# EAGLE design biCycles (EAGLE 5.11)

## Sheet 1 of 3
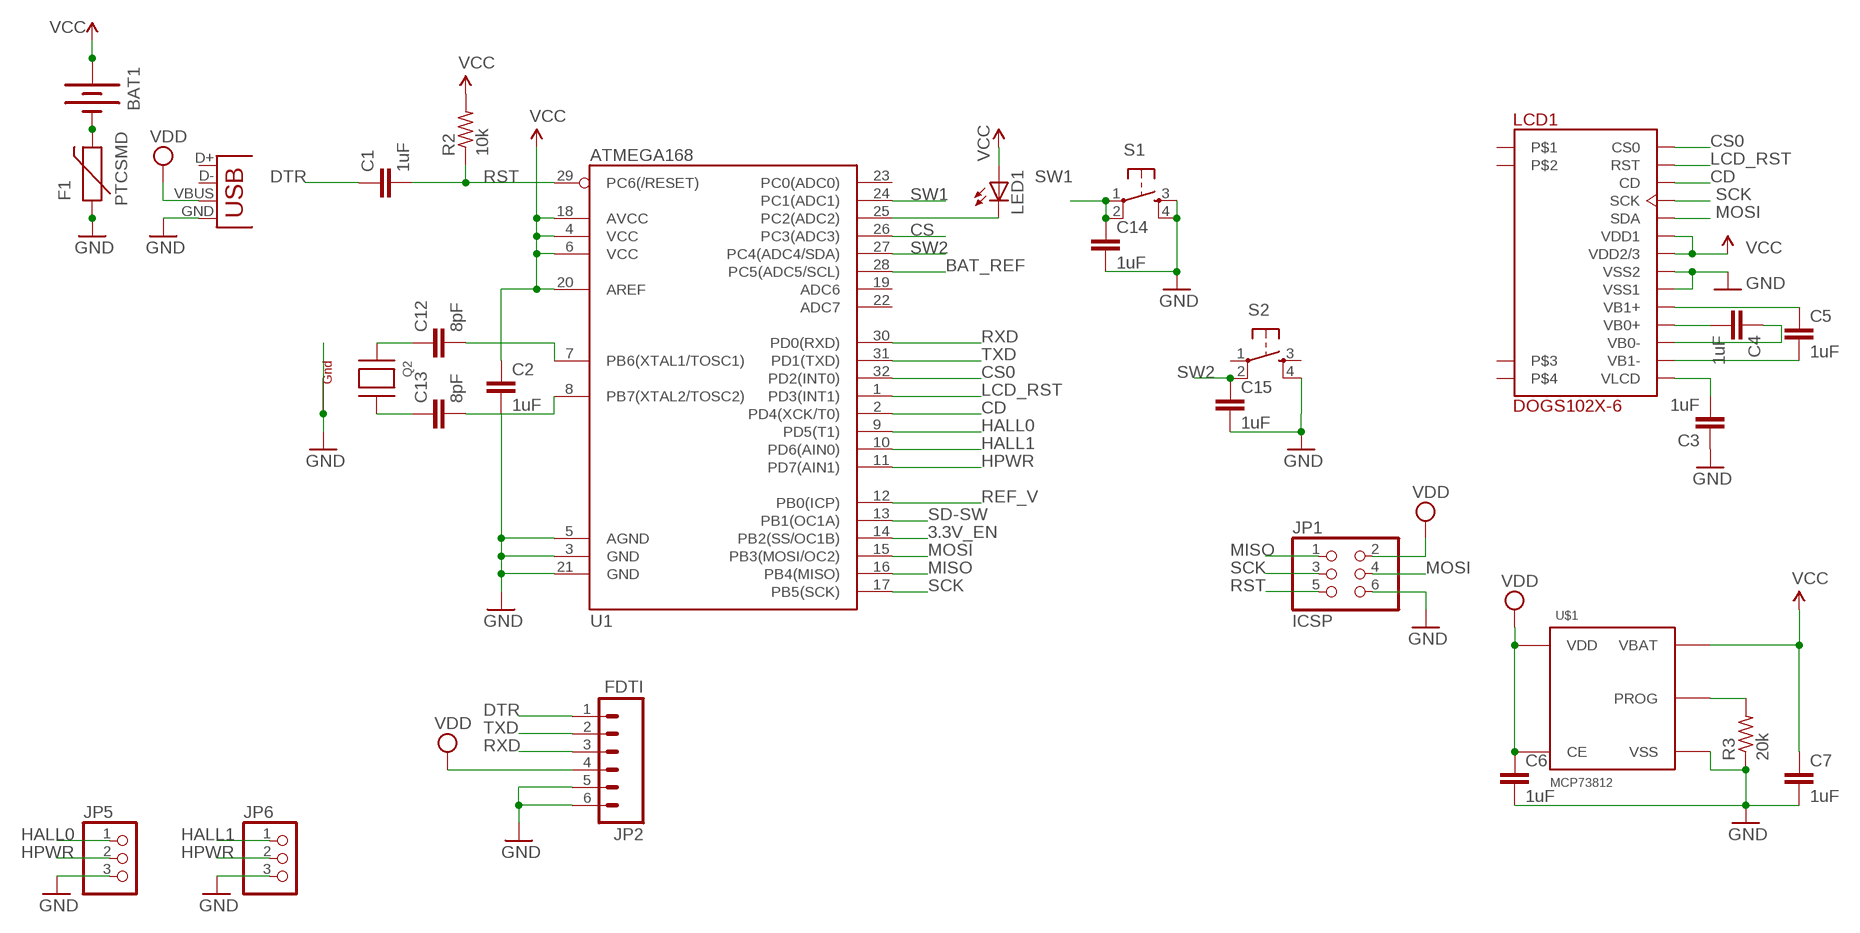
[diagram p0: schematic, sheet 1]

### Parts
BAT1  BATTERY245PTH  [BATTCON_245MM_PTH]
C1  1uF  C-EUC1206  [C1206]
C2  1uF  C-EUC1206  [C1206]
C3  1uF  C-EUC1206  [C1206]
C4  1uF  C-EUC1206  [C1206]
C5  1uF  C-EUC1206  [C1206]
C6  1uF  C-EUC1206  [C1206]
C7  1uF  C-EUC1206  [C1206]
C12  8pF  C-EUC0805  [C0805]
C13  8pF  C-EUC0805  [C0805]
C14  1uF  C-EUC1206  [C1206]
C15  1uF  C-EUC1206  [C1206]
F1  PTCSMD  [PTC-1206]
JP1  ICSP  PINHD-2X3  [2X03]
JP2  FDTI  M06LONGPADS  [1X06_LONGPADS]
JP5  PINHD-1X3  [1X03]
JP6  PINHD-1X3  [1X03]
LCD1  DOGS102X-6  [LCD-28-DIP]
LED1  LED1206  [LED-1206]
Q2  XTAL-4-3225  [NX3225]
R2  10k  R-US_R1206  [R1206]
R3  20k  R-US_R0805  [R0805]
S1  TAC_SWITCHPTH  [TACTILE-PTH]
S2  TAC_SWITCHPTH  [TACTILE-PTH]
U1  ATMEGA168  [TQFP32-08]
U$1  MCP73812  [MCP7381*]
X1  USBSMD  [USB-MINIB]

### Nets
3.3V_EN: U1.14(PB2(SS/OC1B)) ; also sheet 2
BAT_REF: U1.28(PC5(ADC5/SCL))
CD: LCD1.P$26(CD) U1.2(PD4(XCK/T0))
CS: U1.26(PC3(ADC3)) ; also sheet 2
CS0: LCD1.P$28(CS0) U1.32(PD2(INT0))
DTR: C1.1 JP2.1
GND: C2.2 C3.1 C6.2 C7.2 C14.2 C15.2 F1.1 JP1.6 JP2.5 JP2.6 JP5.3 JP6.3 LCD1.P$20(VSS1) LCD1.P$21(VSS2) Q2.2(G2) Q2.4(G1) R3.1 S1.3 S1.4 S2.4 U1.3(GND) U1.5(AGND) U1.21(GND) U$1.VSS X1.GND ; also sheet 2
HALL0: JP5.1 U1.9(PD5(T1))
HALL1: JP6.1 U1.10(PD6(AIN0))
HPWR: JP5.2 JP6.2 U1.11(PD7(AIN1))
LCD_RST: LCD1.P$27(RST) U1.1(PD3(INT1))
MISO: JP1.1 U1.16(PB4(MISO)) ; also sheet 2
MOSI: JP1.4 LCD1.P$24(SDA) U1.15(PB3(MOSI/OC2)) ; also sheet 2
N$1: LED1.C U1.25(PC2(ADC2))
N$2: C3.2 LCD1.P$15(VLCD)
N$3: C5.1 LCD1.P$19(VB1+)
N$4: R3.2 U$1.PROG
N$6: C12.1 Q2.1(X1)
N$7: C5.2 LCD1.P$16(VB1-)
N$8: C4.2 LCD1.P$18(VB0+)
N$9: C4.1 LCD1.P$17(VB0-)
N$14: BAT1.2(-) F1.2
N$15: C13.1 Q2.3(X2)
N$16: C13.2 U1.8(PB7(XTAL2/TOSC2))
N$17: C12.2 U1.7(PB6(XTAL1/TOSC1))
REF_V: U1.12(PB0(ICP))
RST: C1.2 JP1.5 R2.1 U1.29(PC6(/RESET))
RXD: JP2.3 U1.30(PD0(RXD))
SCK: JP1.3 LCD1.P$25(SCK) U1.17(PB5(SCK)) ; also sheet 2
SD-SW: U1.13(PB1(OC1A)) ; also sheet 2
SW1: C14.1 S1.1 S1.2 U1.24(PC1(ADC1))
SW2: C15.1 S2.2 U1.27(PC4(ADC4/SDA))
TXD: JP2.2 U1.31(PD1(TXD))
VCC: BAT1.1(+1) BAT1.3(+) C2.1 C7.1 LCD1.P$22(VDD2/3) LCD1.P$23(VDD1) LED1.A R2.2 U1.4(VCC) U1.6(VCC) U1.18(AVCC) U1.20(AREF) U$1.VBAT ; also sheet 2
VDD: C6.1 JP1.2 JP2.4 U$1.CE U$1.VDD X1.VBUS
Unconnected: LCD1.P$1 LCD1.P$2 LCD1.P$13 LCD1.P$14 S2.1 S2.3 U1.19(ADC6) U1.22(ADC7) U1.23(PC0(ADC0)) X1.D+ X1.D-

## Sheet 2 of 3
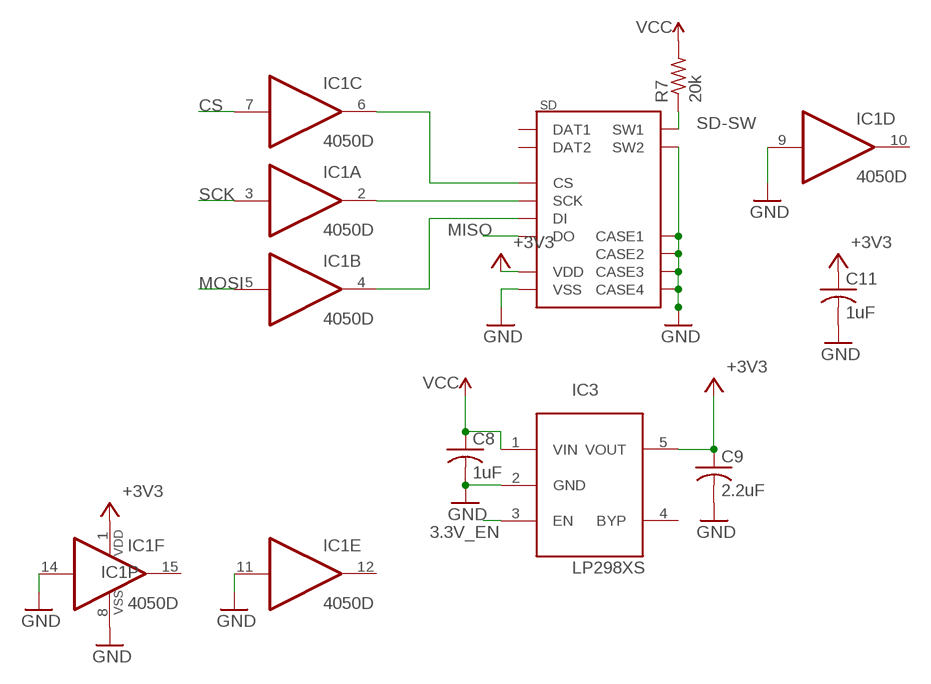
[diagram p1: schematic, sheet 2]

### Parts
C8  1uF  C-USC1206K  [C1206K]
C9  2.2uF  C-USC1206K  [C1206K]
C11  1uF  C-USC1206K  [C1206K]
IC1  4050D  [SO16]
IC3  LP298XS  [SOT23-5L]
R7  20k  R-US_R0805  [R0805]
SD  MICRO-SD  [MICRO-SD]

### Nets
3.3V_EN: IC3.3(EN) ; also sheet 1
3V3: C9.1 C11.1 IC1.1(P:VDD) IC3.5(VOUT) SD.P$4(VDD) ; supply symbol labelled +3V3
CS: IC1.7(C:I) ; also sheet 1
GND: C8.2 C9.2 C11.2 IC1.8(P:VSS) IC1.9(D:I) IC1.11(E:I) IC1.14(F:I) IC3.2(GND) SD.CASE$1(CASE1) SD.CASE$2(CASE2) SD.CASE$3(CASE3) SD.CASE-4(CASE4) SD.P$6(VSS) SD.P$10(SW2) ; also sheet 1
MISO: SD.P$7(DO) ; also sheet 1
MOSI: IC1.5(B:I) ; also sheet 1
N$10: IC1.6(C:O) SD.P$2(CS)
N$12: IC1.2(A:O) SD.P$5(SCK)
N$13: IC1.4(B:O) SD.P$3(DI)
SCK: IC1.3(A:I) ; also sheet 1
SD-SW: R7.1 SD.P$9(SW1) ; also sheet 1
VCC: C8.1 IC3.1(VIN) R7.2 ; also sheet 1
Unconnected: IC1.10(D:O) IC1.12(E:O) IC1.15(F:O) IC3.4(BYP) SD.P$1(DAT2) SD.P$8(DAT1)

## Sheet 3 of 3

## Library data of the parts
BAT1 = SparkFun:BATTERY: Battery Holders Various common sizes : AA, AAA, 20mm coin cell and 12mm coin cell.
C1-C7 C12-C15 = makani_rcl:C-EU: CAPACITOR, European symbol
C8 C9 C11 = adafruit:C-US: CAPACITOR, American symbol
F1 = SparkFun:PTC: Resettable Fuse PTC Resettable Fuse. Spark Fun Electronics SKU : COM-08357
IC1 = 40xx:4050: Hex non-inverting BUFFER
IC3 = adafruit:LP298X
JP1 = pinhead:PINHD-2X3: PIN HEADER
JP2 = SparkFun:M06: Header 6 Standard 6-pin 0.1" header. Use with straight break away headers (SKU : PRT-00116), right angle break away headers (PRT-00553), swiss pins (PRT-00743), machine pins (PRT-00117), and female headers (PRT-00115). Molex polarized connector foot print use with SKU : PRT-08094 with associated crimp pins and housings. NOTES ON THE VARIANTS LOCK and LOCK_LONGPADS... This footprint was designed to help hold the alignment of a through-hole component (i.e. 6-pin header) while soldering it into place. You may notice that each hole has been shifted either up or down by 0.005 of an inch from it's more standard position (which is a perfectly straight line). This slight alteration caused the pins (the squares in the middle) to touch the edges of the holes. Because they are alternating, it causes a "brace" to hold the component in place. 0.005 has proven to be the perfect amount of "off-center" position when using our standard breakaway headers. Although looks a little odd when you look at the bare footprint, once you have a header in there, the alteration is very hard to notice. Also, if you push a header all the way into place, it is covered up entirely on the bottom side. This idea of altering the position of holes to aid alignment will be further integrated into the Sparkfun Library for other footprints. It can help hold any component with 3 or more connection pins.
JP5 JP6 = pinhead:PINHD-1X3: PIN HEADER
LCD1 = josh:DOGS102X-6: Electronic Assemblies DOGS LCD Module This part describes the EA DOGS102x-6 module, a 102x64 pixel LCD display.
LED1 = SparkFun:LED: LEDs Standard schematic elements and footprints for 5mm, 3mm, 1206, and 0603 sized LEDs. 5mm - Spark Fun Electronics SKU : COM-00529 (and others)
Q2 = adafruit:XTAL-4: Classic 4-pin 3.2 x 2.5mm crystal
R2 R3 R7 = rcl:R-US_: RESISTOR, American symbol
S1 S2 = SparkFun:TAC_SWITCH: Momentary Switch Button commonly used for reset or general input. Spark Fun Electronics SKU : COM-00097
SD = josh:MICRO-SD: This micro-sd connector
U1 = SparkFun:ATMEGA168
U$1 = josh:MCP73812
X1 = SparkFun:USB: USB Connectors USB-B-PTH is fully proven SKU : PRT-00139 USB-miniB is fully proven SKU : PRT-00587 USB-A-PCB is untested. USB-A-H is throughly reviewed, but untested. Spark Fun Electronics SKU : PRT-00437 USB-B-SMT is throughly reviewed, but untested. Needs silkscreen touching up. USB-A-S has not been used/tested USB-MB-H has not been used/tested

## Board
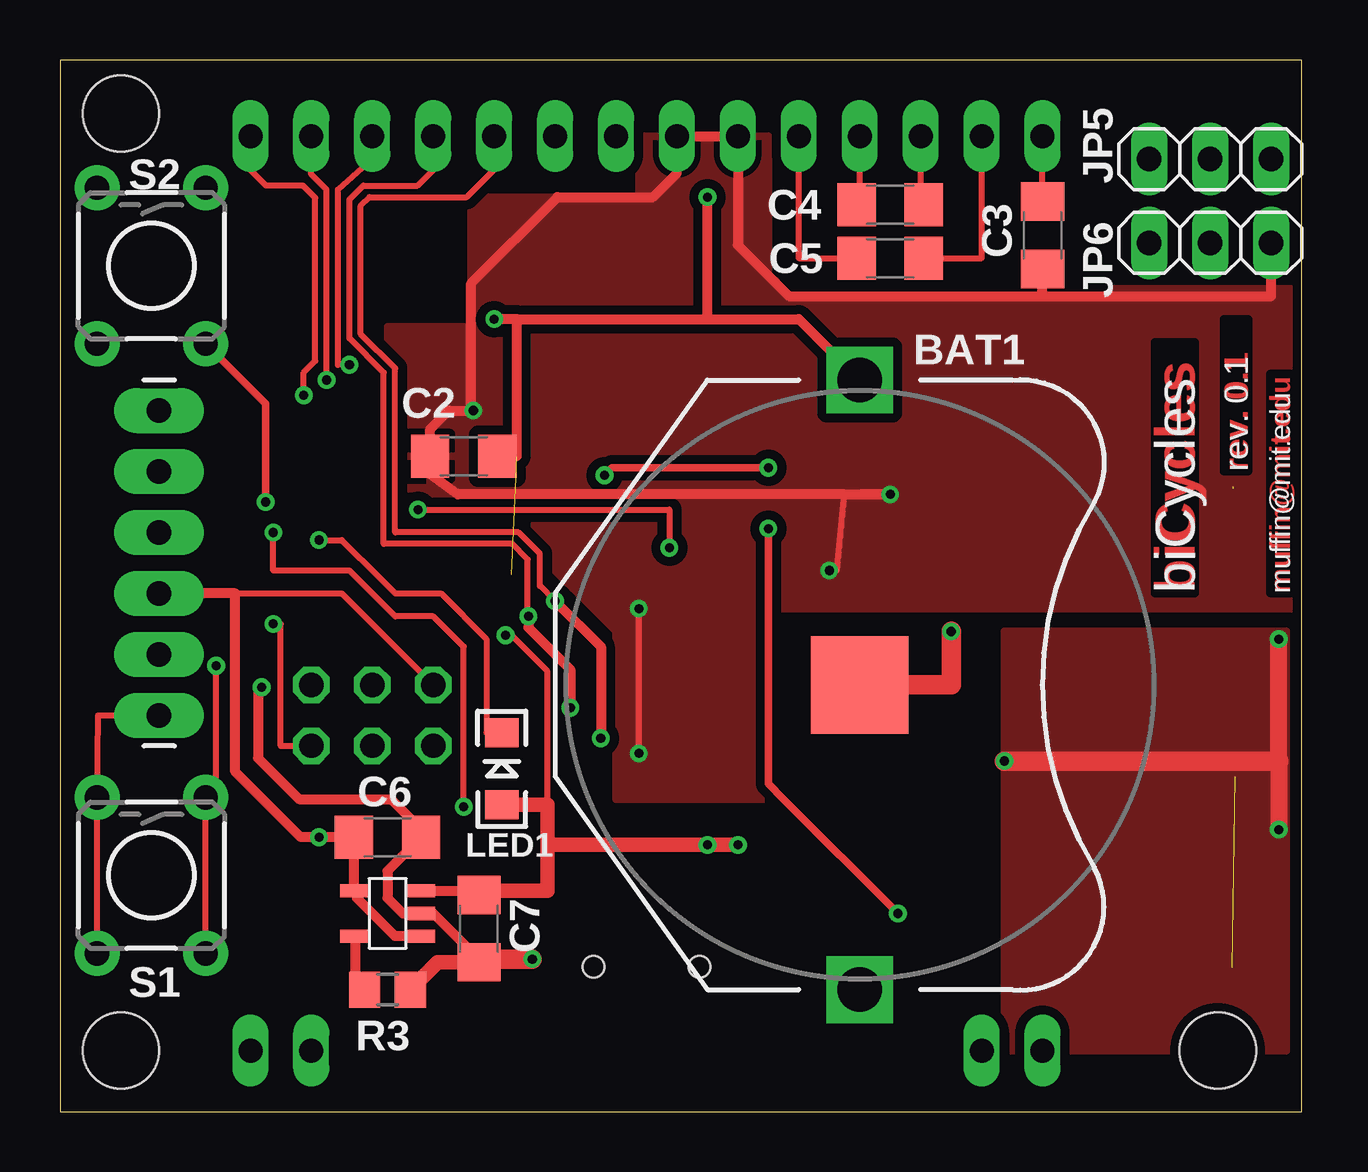
[diagram p2: board, top side]
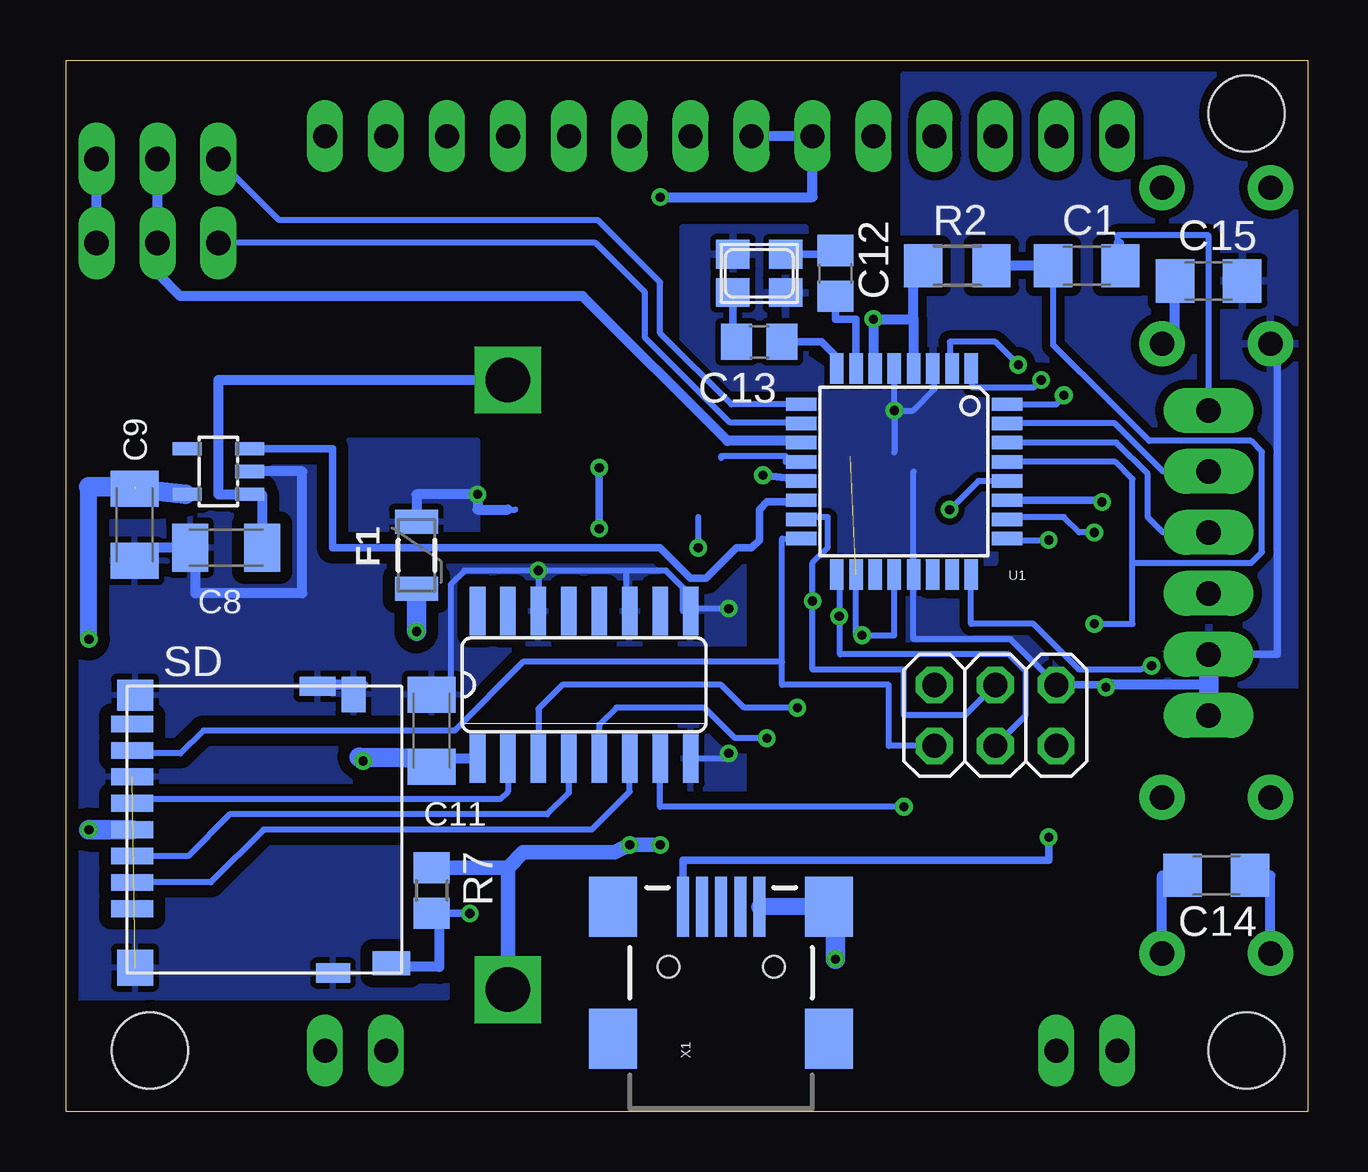
[diagram p3: board, bottom side, seen from below]

Size 51.75 x 43.81 mm. Coordinates in mm from the lower left corner, seen from the top.
Outline: 0,0 51.75,0 51.75,43.81 0,43.81 0,0
Copper layers (1*16): Top 0.0356mm / dielectric 1.5011mm / Bottom 0.0356mm
Design rules "LaenPCBOrder *": minimum track width 6mil, minimum drill 13mil, track to track 6mil, track to pad 6mil, pad to pad 6mil, via to via 6mil, smd to smd 6mil, copper to edge 15mil, drill to drill 6mil, minimum pad ring 7mil, minimum via ring 7mil, stop-mask expansion 4mil, vias tented up to drill 16mil, thermal gap 10mil
Holes 3.17 mm at 48.26,2.54 2.54,2.54 2.54,41.59

### Footprints (pad centres in the part's own frame; a part is rotated, then mirrored left to right if it is on the bottom)
BATTCON_245MM_PTH = drill 1.854 square: 1 -12.7,0; 3 12.7,0 | smd 4.064 x 4.064: 2 0,0
C1206 = smd 1.6 x 1.8: 1 -1.4,0; 2 1.4,0
C1206K = smd 1.5 x 2: 1 -1.5,0; 2 1.5,0
C0805 = smd 1.3 x 1.5: 1 -0.95,0; 2 0.95,0
PTC-1206 = smd 1 x 1.8: 1 -1.4,0; 2 1.4,0
SO16 = smd 0.66 x 2.032: 1 -4.445,-3.073; 2 -3.175,-3.073; 3 -1.905,-3.073; 4 -0.635,-3.073; 5 0.635,-3.073; 6 1.905,-3.073; 7 3.175,-3.073; 8 4.445,-3.073; 9 4.445,3.073; 10 3.175,3.073; 11 1.905,3.073; 12 0.635,3.073; 13 -0.635,3.073; 14 -1.905,3.073; 15 -3.175,3.073; 16 -4.445,3.073
SOT23-5L = smd 0.55 x 1.2: 1 -0.95,-1.3; 2 0,-1.3; 3 0.95,-1.3; 4 0.95,1.3; 5 -0.95,1.3
2X03 = drill 1.016 octagon: 1 -2.54,-1.27; 2 -2.54,1.27; 3 0,-1.27; 4 0,1.27; 5 2.54,-1.27; 6 2.54,1.27
1X06_LONGPADS = drill 1.016 pad 1.88 long: 1 0,0; 2 2.54,0; 3 5.08,0; 4 7.62,0; 5 10.16,0; 6 12.7,0
1X03 = drill 1.016 long: 1 -2.54,0; 2 0,0; 3 2.54,0
LCD-28-DIP = drill 1 long: P$1 -16.51,-19.05; P$2 -13.97,-19.05; P$13 13.97,-19.05; P$14 16.51,-19.05; P$15 16.51,19.05; P$16 13.97,19.05; P$17 11.43,19.05; P$18 8.89,19.05; P$19 6.35,19.05; P$20 3.81,19.05; P$21 1.27,19.05; P$22 -1.27,19.05; P$23 -3.81,19.05; P$24 -6.35,19.05; P$25 -8.89,19.05; P$26 -11.43,19.05; P$27 -13.97,19.05; P$28 -16.51,19.05
LED-1206 = smd 1.2 x 1.4: A -1.5,0; C 1.5,0
NX3225 = smd 1.4 x 1.2: 1 -1.1,-0.8; 2 1.1,-0.8; 3 1.1,0.8; 4 -1.1,0.8
R1206 = smd 1.6 x 1.803: 1 -1.422,0; 2 1.422,0
R0805 = smd 1.3 x 1.5: 1 -0.95,0; 2 0.95,0
TACTILE-PTH = drill 1.016 pad 1.88 round: 1 -3.251,2.261; 2 3.251,2.261; 3 -3.251,-2.261; 4 3.251,-2.261
MICRO-SD = smd 1.3 x 1.5: CASE$1 -5.6,-5.38 | smd 1.5 x 1.5: CASE$2 5.75,-5.375 | smd 0.8 x 1.5: CASE$3 -5.975,2.225 | smd 0.8 x 1.4: CASE-4 5.975,2.875 | smd 0.7 x 1.75: P$1 3.3,-5.5; P$2 2.2,-5.5; P$3 1.1,-5.5; P$4 0,-5.5; P$5 -1.1,-5.5; P$6 -2.2,-5.5; P$7 -3.3,-5.5; P$8 -4.4,-5.5 | smd 1 x 1.55: P$9 5.575,5.3 | smd 1.475 x 1: P$10 -5.638,3.725
TQFP32-08 = smd 1.27 x 0.559: 1 -4.293,2.8; 2 -4.293,2; 3 -4.293,1.2; 4 -4.293,0.4; 5 -4.293,-0.4; 6 -4.293,-1.2; 7 -4.293,-2; 8 -4.293,-2.8; 17 4.293,-2.8; 18 4.293,-2; 19 4.293,-1.2; 20 4.293,-0.4; 21 4.293,0.4; 22 4.293,1.2; 23 4.293,2; 24 4.293,2.8 | smd 0.559 x 1.27: 9 -2.8,-4.293; 10 -2,-4.293; 11 -1.2,-4.293; 12 -0.4,-4.293; 13 0.4,-4.293; 14 1.2,-4.293; 15 2,-4.293; 16 2.8,-4.293; 25 2.8,4.293; 26 2,4.293; 27 1.2,4.293; 28 0.4,4.293; 29 -0.4,4.293; 30 -1.2,4.293; 31 -2,4.293; 32 -2.8,4.293
MCP7381* = smd 1.27 x 0.55: CE 1.35,-0.95; PROG -1.35,-0.95; VBAT 1.35,0.95; VDD -1.35,0.95; VSS 1.35,0
USB-MINIB = smd 2.5 x 0.5: D+ 2.5,0; D- 2.5,0.8; GND 2.5,-1.6; ID 2.5,-0.8; VBUS 2.5,1.6 | smd 2.5 x 2: GND@1 -3,-4.5; GND@2 -3,4.5; GND@3 2.5,4.5; GND@4 2.5,-4.5 | hole 0.9: 0,2.2; 0,-2.2

### Placement (x,y rotation side)
BAT1  33.34,17.78 270 top
C1  9.21,35.24 180 bottom
C2  16.83,27.3 180 top
C3  40.96,36.51 90 top
C4  34.61,37.78 180 top
C5  34.61,35.56 0 top
C6  13.65,11.43 0 top
C7  17.46,7.62 270 top
C8  45.09,23.5 180 bottom
C9  48.9,24.45 270 bottom
C11  36.51,15.88 90 bottom
C12  19.68,34.92 270 bottom
C13  22.86,32.07 0 bottom
C14  3.81,9.84 0 bottom
C15  4.13,34.61 0 bottom
F1  37.15,23.18 270 bottom
IC1  30.16,17.78 0 bottom
IC3  45.4,26.67 90 bottom
JP1  13.02,16.51 0 bottom
JP2  4.13,29.21 270 top
JP5  47.94,39.69 0 top
JP6  47.94,36.2 0 top
LCD1  24.45,21.59 0 top
LED1  18.41,14.29 90 top
Q2  22.86,34.92 180 bottom
R2  14.61,35.24 180 bottom
R3  13.65,5.08 180 top
R7  36.51,9.21 90 bottom
S1  3.81,9.84 270 top
S2  3.81,35.24 270 top
SD  43.5,11.75 270 bottom
U1  16.83,26.67 270 bottom
U$1  13.65,8.26 0 top
X1  24.45,6.03 90 bottom

### Tracks (layer width: path | path; a pad name or v marks a point on that pad's centre or on a via)
3.3V_EN
  Bottom 0.305: IC3.3 40.64,27.62 40.64,23.5 26.99,23.5 25.72,22.23 25.08,22.23 23.81,23.5 23.18,23.5 22.86,23.81 22.86,25.08 22.54,25.4 21.12,25.4 U1.14
3V3  (via drill 0.38)  (1 unrouted)
  Top 0.711: v50.8,11.75 50.8,14.61 v50.8,19.68
  Top 0.813: v39.37,14.61 50.8,14.61
  Bottom 0.254: C11.1 36.19,14.38 36.19,14.71
  Bottom 0.406: IC3.5 46.76,25.72 | IC1.1 35.88,14.71 36.19,14.71 | 39.53,14.76 39.53,14.61 v39.37,14.61
  Bottom 0.711: v50.8,19.68 50.8,26.04
  Bottom 0.813: 46.76,25.72 C9.1 | v50.8,11.75 SD.P$4 | 50.8,26.04 48.9,26.04 | 36.19,14.71 39.53,14.76
  pour Top (isolate 0.381): 39.37,20 51.12,20 51.12,2.54 39.37,2.54
BAT_REF  (via drill 0.38 pad 0.25)
  Top 0.254: v25.4,23.5 25.4,25.08 v14.92,25.08
  Bottom 0.254: U1.28 13.73,26.27 v14.92,25.08 | v25.4,23.5 25.4,24.77
CD  (via drill 0.38 pad 0.25)
  Top 0.254: v12.06,31.11 11.59,31.11 11.59,38.42 13.02,39.69 LCD1.P$26
  Bottom 0.254: U1.2 14.92,30.96 14.92,32.07 13.02,32.07 v12.06,31.11
CS  (via drill 0.38)
  Top 0.254: v16.83,12.7 16.83,19.37 15.56,20.64 13.97,20.64 12.06,22.54 8.89,22.54 v8.89,24.13
  Bottom 0.254: v16.83,12.7 26.99,12.7 IC1.7 | v8.89,24.13 9.53,24.13 10.16,24.77 12.54,24.77 U1.26
CS0  (via drill 0.38 pad 0.25)
  Top 0.254: v10.16,29.84 10.16,30.8 10.64,31.27 10.64,38.07 10.13,38.58 8.59,38.58 7.94,39.23 LCD1.P$28 7.94,40.32
  Bottom 0.254: U1.32 10.48,29.47 10.16,29.79 v10.16,29.84
DTR
  Bottom 0.254: JP2.1 4.13,35.24 4.13,36.51 7.94,36.51 7.94,36.2 | 7.81,36.2 C1.1
  Bottom 0.305: 7.94,36.2 7.81,36.2
GND  (via drill 0.38, 0.38 pad 0.25)  (1 unrouted)
  Top 0.254: JP2.6 1.59,16.51 S1.3 S1.4 | R3.1 15.07,5.52 | 14.29,8.26 U$1.VSS | v8.41,17.68 8.57,17.68 | 15.05,11.76 C6.2 | 17.46,6.35 C7.2 | v24.13,14.92 v24.13,20.95 | v32.07,22.54 32.38,22.54 32.7,25.72
  Top 0.305: 8.57,17.68 8.26,17.78
  Top 0.406: 17.46,6.35 15.56,8.26 U$1.VSS | 14.29,8.26 13.65,8.89 13.65,10.03 C6.2 | 15.05,11.76 13.8,13.02 9.96,13.02 8.26,14.73 8.26,17.78 | 40.96,33.97 C3.1 | 40.96,33.97 30.39,33.97 28.26,36.1 LCD1.P$20 LCD1.P$21 25.72,39.1 24.71,38.1 20.74,38.1 17.14,34.51 17.14,29.21 | 33.34,25.72 v34.61,25.72 32.7,25.72 16.57,25.72 15.43,26.55 C2.2 15.43,28.43 16.2,29.21 17.14,29.21 | 40.96,33.97 50.48,33.97 JP6.3 | 17.14,29.21 v17.23,29.21
  Top 0.61: R3.1 15.74,6.22 C7.2
  Top 0.813: 17.46,6.35 v19.68,6.35
  Bottom 0.254: U1.21 16.45,22.38 | v17.23,29.21 17.23,27.47 | v17.23,29.21 U1.5 | U1.21 16.43,26.67 | U1.3 15.56,30.96 15.56,30.11 16.46,29.21 v17.23,29.21 | v8.41,17.68 8.57,17.68 8.57,17.78 | JP1.6 12.38,19.68 16.43,19.68 U1.21 | 33.02,25.09 33.02,25.08 33.34,25.08 | 28.42,22.54 v32.07,22.54 | 28.42,22.54 26.75,22.54 26.04,21.83 26.04,20.85 IC1.9 25.72,20.95 v24.13,20.95 | IC1.11 28.42,20.85 28.42,22.54 | v32.07,22.54 IC1.14 | IC1.8 24.13,14.71 v24.13,14.92 | C11.2 35.72,17.38 35.72,21.97 35.15,22.54 v32.07,22.54
  Bottom 0.305: 8.57,17.78 JP1.6 | S2.4 1.27,31.99 1.27,19.05 JP2.5
  Bottom 0.406: 4.13,17.78 8.57,17.78 | JP6.3 JP5.3 | SD.P$10 40.01,17.39 40.01,17.78 | 40.01,17.78 41.27,17.78 SD.CASE$3 | 40.01,17.78 39.37,17.78 | 33.34,25.08 34.61,25.08 v34.61,25.72 37.15,25.72 F1.1 | C9.2 48.9,23.5 C8.2 46.35,23.5 46.35,21.59 41.91,21.59 41.91,26.67 IC3.2 | C14.2 1.55,9.84 S1.4
  Bottom 0.711: 19.68,8.53 X1.GND
  Bottom 0.813: JP2.6 4.13,17.78 JP2.5 | v19.68,6.35 19.68,8.53
  pour Bottom (isolate 0.254): 13.02,30.48 20.64,30.48 20.64,22.86 13.02,22.86
  pour Bottom (isolate 0.508): 51.75,27.94 51.75,4.76 35.88,4.76 35.88,13.02 23.5,13.02 23.5,23.5 34.61,23.5 34.61,27.94
  pour Bottom (isolate 0.241): 19.05,30.16 20.95,31.43 20.95,36.83 26.04,36.83 26.04,30.16
  pour Top (isolate 0.381): 43.81,33.97 29.84,33.97 29.84,34.61 29.53,34.61 29.53,40.64 24.13,40.64 24.13,38.1 17.14,38.1 17.14,32.7 13.65,32.7 13.65,23.5 19.68,23.5 23.18,20 23.18,13.02 29.53,13.02 29.53,20.95 43.81,20.95
  pour Top (isolate 0.178): 43.81,34.29 51.75,34.29 51.75,20.95 43.81,20.95
  pour Bottom (isolate 0.356): 16.51,30.16 16.83,30.16 16.83,43.18 0,43.18 0,17.78 16.83,17.78 16.83,29.53
HALL0
  Bottom 0.254: U1.9 24.02,29.46 26.99,32.43 26.99,34.55 29.59,37.15 42.86,37.15 JP5.1
HALL1
  Bottom 0.254: 21.21,28.57 U1.10 21.15,28.7 24.08,28.7 27.62,32.24 27.62,34.14 29.68,36.2 JP6.1
HPWR
  Bottom 0.254: U1.11 21.19,27.94
  Bottom 0.406: JP5.2 JP6.2 47.94,34.92 46.99,33.97 30.22,33.97 24.19,27.94 21.19,27.94
LCD_RST  (via drill 0.38 pad 0.25)
  Top 0.254: v11.11,30.48 11.11,38.42 10.48,39.05 LCD1.P$27
  Bottom 0.254: U1.1 13.97,30.96 13.97,30.16 11.43,30.16 v11.11,30.48
MISO
  Bottom 0.254: U1.16 21.91,23.87 21.91,18.73 | JP1.1 17.46,15.24 17.46,17.78 21.91,17.78 21.91,18.73 | 49,14.92 46.99,14.92 46.04,15.88 35.56,15.88 32.7,18.73 21.91,18.73
  Bottom 0.406: 49,14.92 SD.P$7
MOSI  (via drill 0.38, 0.38 pad 0.25)
  Top 0.254: LCD1.P$24 18.1,39.24 16.95,38.1 12.9,38.1 12.54,37.74 12.54,32.4 13.97,30.97 13.97,24.13 19.11,24.13 20,23.23 20,21.91 v20.64,21.27
  Top 0.406: v20.64,21.27 22.54,19.37 v22.54,15.56
  Bottom 0.254: JP1.4 14.29,16.51 16.83,16.51 16.83,18.41 20.64,18.41 v20.64,21.27 20.64,22.86 20,23.5 20,24.77 21.12,24.77 U1.15 | v22.54,15.56 23.86,15.56 25.13,16.83 28.82,16.83 29.53,16.12 IC1.5
N$1  (via drill 0.38)
  Top 0.254: LED1.C 17.78,15.79 17.78,19.68 15.88,21.59 13.97,21.59 13.34,22.23 11.75,23.81 v10.79,23.81
  Bottom 0.254: v10.79,23.81 12.54,23.81 U1.25
N$2
  Top 0.254: C3.2 LCD1.P$15
N$3
  Top 0.254: C5.1 30.8,35.56 LCD1.P$19
N$4
  Top 0.254: U$1.PROG 12.23,7.3 | 12.3,5.08 R3.2
  Top 0.406: U$1.PROG 12.3,5.08
N$6
  Bottom 0.305: Q2.1 19.68,35.73 C12.1
N$7
  Top 0.254: C5.2 38.42,35.56 LCD1.P$16
N$8
  Top 0.254: C4.2 33.34,37.15 LCD1.P$18
N$9
  Top 0.254: C4.1 35.88,37.15 LCD1.P$17
N$10
  Bottom 0.254: SD.P$2 45.72,9.55 43.52,11.75 29.84,11.75 28.26,13.34 IC1.6
N$12
  Bottom 0.254: IC1.2 33.34,13.34 33.66,13.02 49,13.02 SD.P$5
N$13
  Bottom 0.254: SD.P$3 46.67,10.65 44.94,12.38 31.7,12.38 30.8,13.28 IC1.4
N$14  (via drill 0.38)
  Top 0.813: BAT1.2 37.15,17.78 v37.15,20
  Bottom 0.813: v37.15,20 F1.2
N$15
  Bottom 0.305: C13.1 23.96,31.75 Q2.3
N$16
  Bottom 0.305: U1.8 19.63,31.43 20.27,32.07 C13.2
N$17
  Bottom 0.305: C12.2 19.68,33.02 18.83,33.02 U1.7
REF_V
  Bottom 0.254: U1.12 21.75,27.07 21.75,27.3 24.45,27.3 24.45,27.23
RST  (via drill 0.38 pad 0.25)
  Top 0.254: v8.89,20.32 9.21,20.32 9.21,15.24 JP1.5
  Bottom 0.254: 7.3,22.86 2.35,22.86 1.91,23.31 1.91,27.49 2.35,27.94 6.61,27.94 8.26,29.59 10.61,31.94 C1.2 | 7.3,22.86 7.3,26.35 8.02,27.07 U1.29 | 7.3,22.86 7.3,20.32 v8.89,20.32
  Bottom 0.406: C1.2 R2.1
RXD
  Bottom 0.254: 5.01,24.13 JP2.3 6.03,24.13 6.67,24.77 6.67,26.57 7.97,27.87 U1.30
SCK  (via drill 0.38, 0.38 pad 0.25)
  Top 0.254: LCD1.P$25 15.56,39.23 14.9,38.58 12.64,38.58 12.06,38 12.06,32.22 13.49,30.79 13.49,23.65 18.84,23.65 19.49,23 19.49,20.64 v19.53,20.64
  Top 0.406: v19.53,20.64 19.53,20.16 21.27,18.41 v21.27,16.83
  Bottom 0.254: U1.17 19.49,22.38 19.49,20.64 | 19.49,20.64 19.49,19.05 12.46,19.05 11.75,18.34 11.75,16.51 JP1.3 | 19.49,20.64 v19.53,20.64 | v21.27,16.83 23.5,16.83 24.45,17.78 31.06,17.78 32.07,16.78 IC1.3
SD-SW  (via drill 0.38)
  Top 0.305: v29.53,26.83 23.02,26.83 v22.7,26.51 | v34.92,8.26 30.16,13.02 29.53,13.65 v29.53,24.29
  Bottom 0.305: U1.13 21.2,26.35 v22.7,26.51 | v34.92,8.26 R7.1 | v29.53,24.29 v29.53,26.83
  Bottom 0.406: R7.1 36.2,8.26 36.2,6.03 38.2,6.03 SD.P$9
SW1  (via drill 0.38)
  Top 0.254: S1.2 S1.1 6.51,12.78 v6.51,18.57 | v6.51,18.57
  Bottom 0.254: v6.51,18.57 | v6.51,18.57 6.99,18.41 9.53,18.41 11.43,20.32 14.03,20.32 U1.24
  Bottom 0.406: C14.1 6.07,9.84 S1.2
SW2  (via drill 0.38)
  Top 0.305: S2.2 8.57,29.49 v8.57,25.4
  Bottom 0.305: v8.57,25.4 8.64,25.47 U1.27
  Bottom 0.406: S2.2 5.53,31.99 C15.1
TXD
  Bottom 0.254: JP2.2 6.03,26.67 8.03,28.67 U1.31
VCC  (via drill 0.38, 0.38 pad 0.25)  (1 unrouted)
  Top 0.254: 17.46,9.21 C7.1 | 20.32,11.11 20.32,18.35 18.82,19.84 v18.57,19.84
  Top 0.406: U$1.VBAT 17.46,9.21 | 19.05,33.02 19.05,27.3 C2.1 | 19.05,33.02 26.99,33.02 | 26.99,33.02 v26.99,38.1 | 26.99,33.02 30.8,33.02 BAT1.1 | 19.05,33.02 v18.1,33.02
  Top 0.61: 17.46,9.21 20.32,9.21 20.32,11.11 | LED1.A 20.32,12.79 20.32,11.11 | 20.32,11.11 v26.99,11.11 v28.26,11.11
  Bottom 0.254: 17.21,22.38 U1.20 17.23,19.84 v18.57,19.84 18.83,19.84 U1.18 | 18.1,30.96 U1.6
  Bottom 0.406: 16.43,33.02 U1.4 | 18.1,30.96 v18.1,33.02 16.43,33.02 | LCD1.P$22 LCD1.P$23 20.64,38.1 v26.99,38.1 | C8.1 43.59,25.72 IC3.1 45.4,25.72 45.4,30.48 BAT1.1 | R2.2 16.43,35.24 16.43,33.02
  Bottom 0.61: 33.34,10.16 R7.2 | 33.34,10.16 BAT1.3 | 33.34,10.16 32.7,10.79 28.89,10.79 v28.26,11.11 v26.99,11.11
VDD  (via drill 0.38)
  Top 0.254: 12.38,8.89 12.38,9.21 U$1.VDD 12.25,9.21 | 7.3,21.59 11.75,21.59 JP1.2
  Top 0.406: JP2.4 7.3,21.59 7.3,14.16 10.03,11.43 v10.79,11.43 C6.1 12.25,9.21 | 12.38,8.89 13.97,7.3 U$1.CE
  Bottom 0.254: 26.04,8.53 X1.VBUS
  Bottom 0.305: 26.04,8.53 26.04,10.48 10.79,10.48 v10.79,11.43

### Text on the board
Top: rev. 0.1 | biCycles | muffin@mit.edu
_tsilk: rev. 0.1 | biCycles | muffin@mit.edu